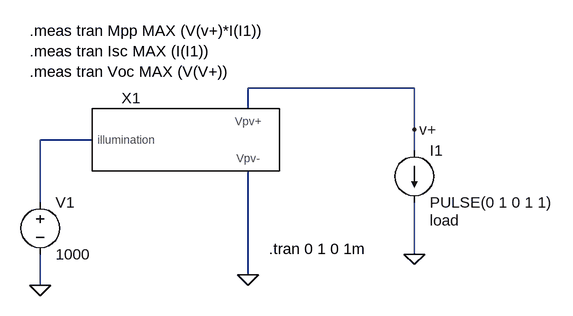
[diagram p0: schematic Test_SingolaCella.asc]
Test_SingolaCella.asc, the LTspice schematic file:
Version 4
SHEET 1 880 680
WIRE 512 96 256 96
WIRE 256 128 256 96
WIRE 512 160 512 96
WIRE 16 176 -64 176
WIRE 512 192 512 160
WIRE -64 272 -64 176
WIRE 512 352 512 272
WIRE 256 384 256 224
WIRE -64 400 -64 352
FLAG -64 400 0
FLAG 256 384 0
FLAG 512 352 0
FLAG 512 160 v+
SYMBOL CellaFotovoltaica 192 176 R0
WINDOW 0 -116 -49 Bottom 2
SYMATTR InstName X1
SYMBOL voltage -64 256 R0
WINDOW 123 0 0 Left 0
WINDOW 39 0 0 Left 0
SYMATTR InstName V1
SYMATTR Value 1000
SYMBOL current 512 192 R0
WINDOW 123 0 0 Left 0
WINDOW 39 24 108 Left 2
SYMATTR SpiceLine load
SYMATTR InstName I1
SYMATTR Value PULSE(0 1 0 1 1)
TEXT 288 344 Left 2 !.tran 0 1 0 1m
TEXT -80 8 Left 2 !.meas tran Mpp MAX (V(v+)*I(I1))\n.meas tran Isc MAX (I(I1))\n.meas tran Voc MAX (V(V+))

The netlist it stands for:
* Test_SingolaCella.asc
XX1 N001 v+ 0 CellaFotovoltaica  ; pins illumination Vpv+ Vpv-
V1 N001 0 1000
I1 v+ 0 PULSE(0 1 0 1 1) load
.tran 0 1 0 1m
.meas tran Mpp MAX (V(v+)*I(I1))
.meas tran Isc MAX (I(I1))
.meas tran Voc MAX (V(V+))
.backanno
.end